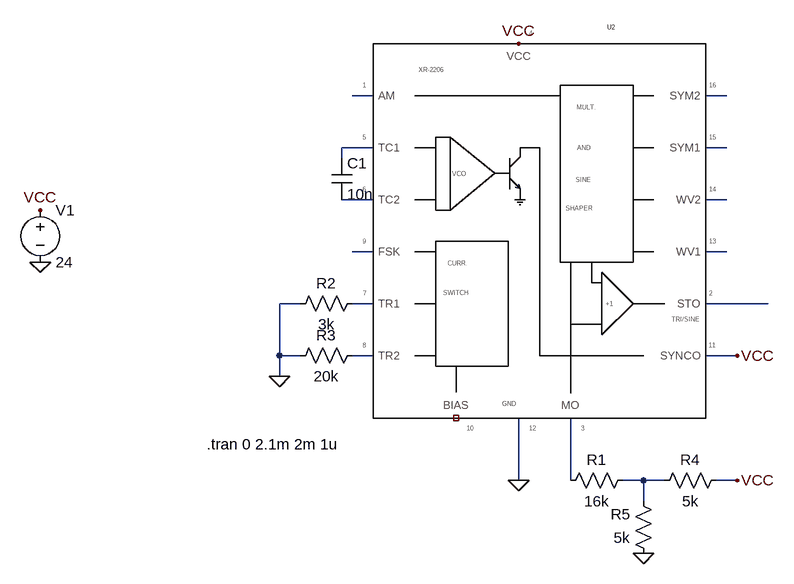
[diagram p0: schematic Triangle wave gen XR2206.asc]
Triangle wave gen XR2206.asc, the LTspice schematic file:
Version 4.1
SHEET 1 880 680
WIRE 16 -48 -16 -48
WIRE 560 -48 528 -48
WIRE 16 32 -32 32
WIRE 560 32 528 32
WIRE -32 48 -32 32
WIRE 16 112 -32 112
WIRE 560 112 528 112
WIRE 16 192 -16 192
WIRE 560 192 528 192
WIRE -96 272 -128 272
WIRE 16 272 -16 272
WIRE 624 272 528 272
WIRE -128 352 -128 272
WIRE -96 352 -128 352
WIRE 16 352 -16 352
WIRE 576 352 528 352
WIRE -128 384 -128 352
WIRE 240 544 240 448
WIRE 320 544 320 448
WIRE 432 544 400 544
WIRE 464 544 432 544
WIRE 576 544 544 544
WIRE 432 576 432 544
FLAG -128 384 0
FLAG 240 544 0
FLAG -496 128 VCC
FLAG 240 -128 VCC
FLAG -496 208 0
FLAG 576 352 VCC
FLAG 576 544 VCC
FLAG 432 656 0
SYMBOL cap -48 48 R0
SYMATTR InstName C1
SYMATTR Value 10n
SYMBOL res -112 288 R270
WINDOW 0 32 56 VTop 2
WINDOW 3 0 56 VBottom 2
SYMATTR InstName R2
SYMATTR Value 3k
SYMBOL voltage -496 112 R0
WINDOW 123 0 0 Left 0
WINDOW 39 0 0 Left 0
SYMATTR InstName V1
SYMATTR Value 24
SYMBOL res -112 368 R270
WINDOW 0 32 56 VTop 2
WINDOW 3 0 56 VBottom 2
SYMATTR InstName R3
SYMATTR Value 20k
SYMBOL res 416 528 R90
WINDOW 0 0 56 VBottom 2
WINDOW 3 32 56 VTop 2
SYMATTR InstName R1
SYMATTR Value 16k
SYMBOL res 560 528 R90
WINDOW 0 0 56 VBottom 2
WINDOW 3 32 56 VTop 2
SYMATTR InstName R4
SYMATTR Value 5k
SYMBOL res 448 672 R180
WINDOW 0 36 76 Left 2
WINDOW 3 36 40 Left 2
SYMATTR InstName R5
SYMATTR Value 5k
SYMBOL ZmySymbol\\IC\\XR2206 112 32 R0
SYMATTR InstName U2
TEXT -240 488 Left 2 !.tran 0 2.1m 2m 1u

The netlist it stands for:
* Triangle wave gen XR2206.asc
C1 N003 N005 10n
R2 0 N009 3k
V1 VCC 0 24
R3 0 N011 20k
R1 N013 N012 16k
R4 VCC N013 5k
R5 0 N013 5k
X§U2 N001 N010 N012 VCC N003 N005 N009 N011 N007 NC_01 VCC 0 N008 N006 N004 N002 XR2206  ; pins AM STO MO VCC TC1 TC2 TR1 TR2 FSK BIAS SYNCO COM WV1 WV2 SYM1 SYM2
.tran 0 2.1m 2m 1u
.lib XR2206.sub
.backanno
.end